# EAGLE design TalkingTom_FINAL9 (EAGLE 7.3.0)
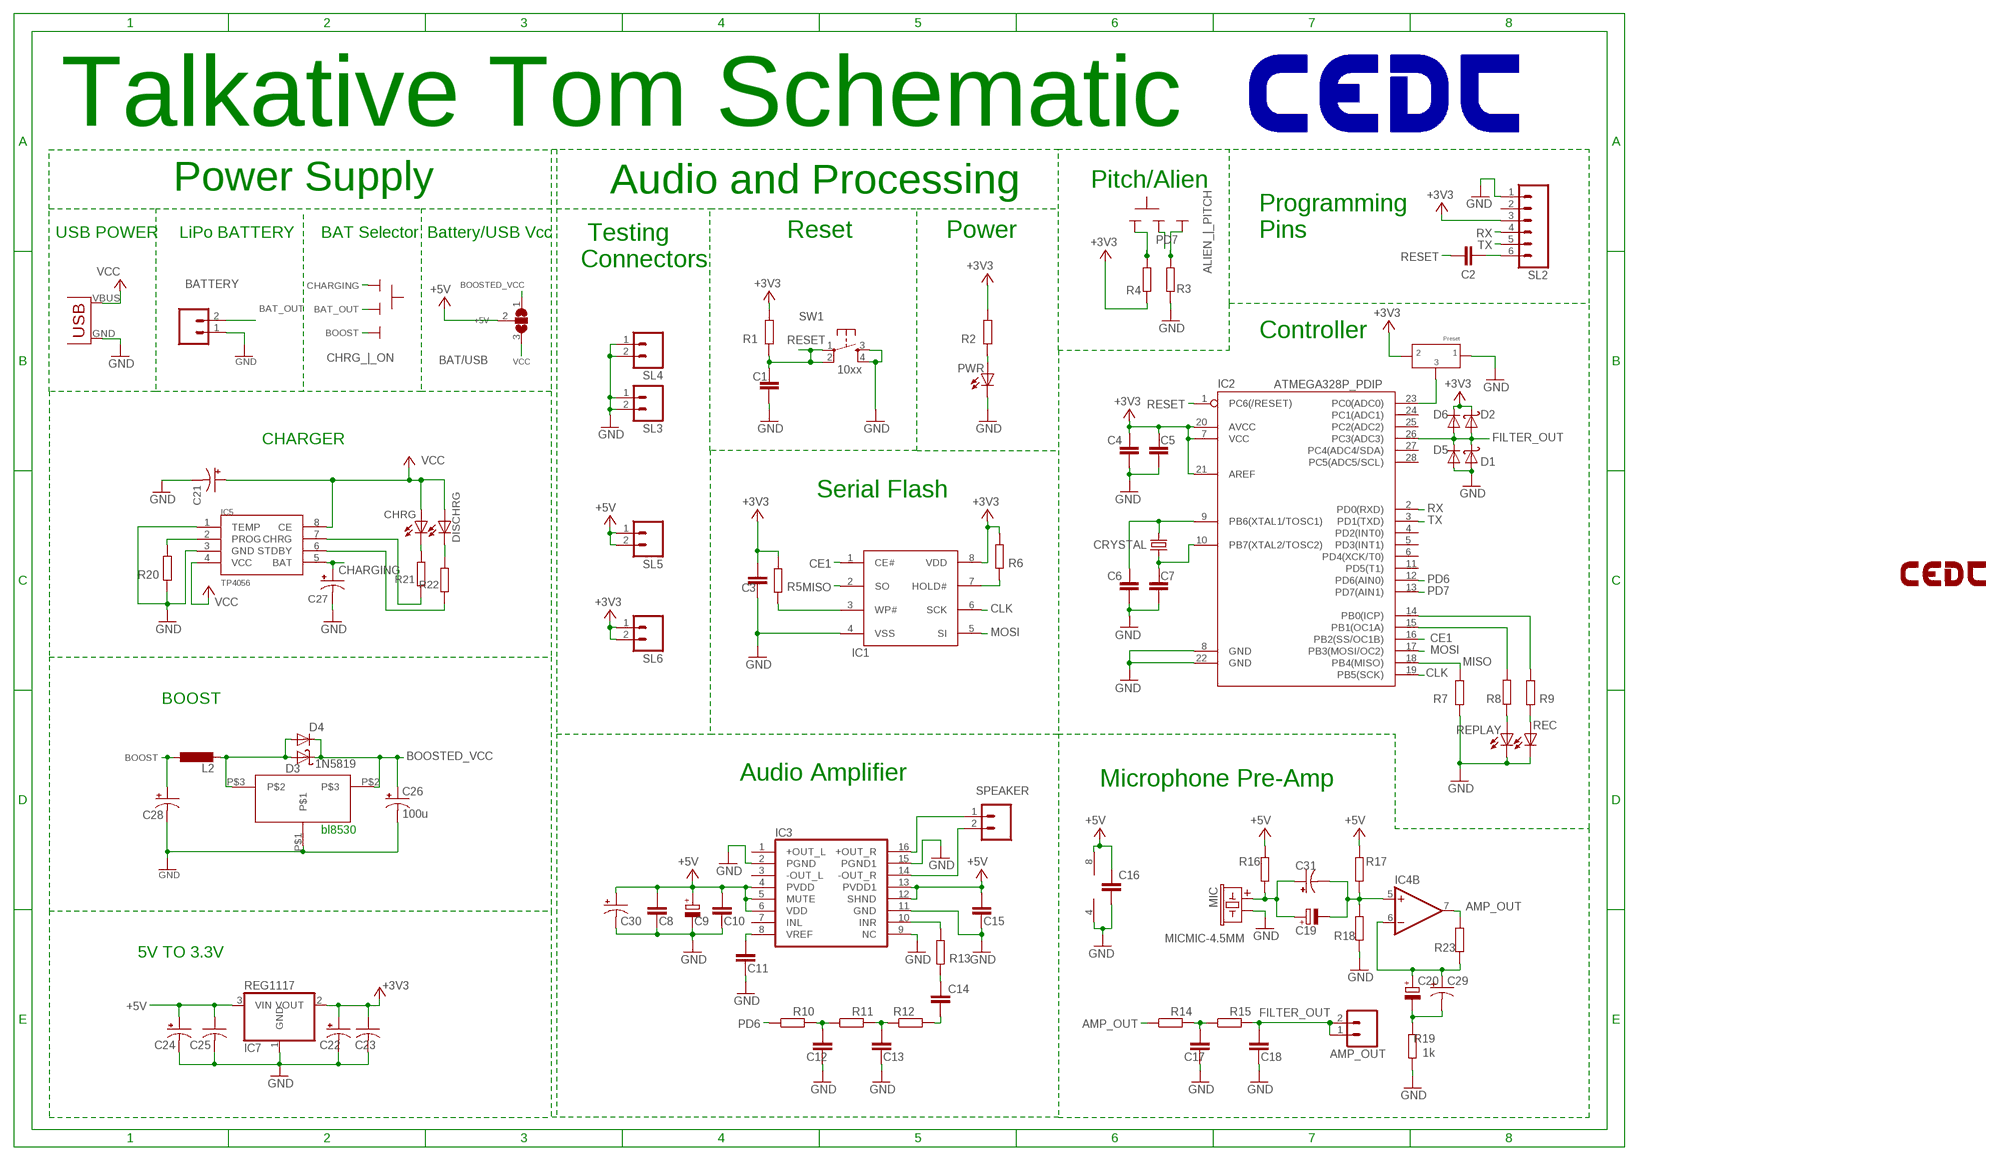
[diagram p0: schematic, sheet 1]

## Parts
ALIEN_|_PITCH  SLIDESWITCH-BIG  [BIGSWITCH]
AMP_OUT  M02  [02P]
BAT/USB  SJ2W  [SJ_2]
BATTERY  M02JST-PTH-2  M02  [02P]
C1  0.1u  C-EUC0805  [C0805]
C2  1uf  C-EUC1206K  [C1206K]
C3  0.1u  C-EUC0805  [C0805]
C4  0.1u  C-EUC0805  [C0805]
C5  0.1u  C-EUC0805  [C0805]
C6  22pf  C-EUC0805  [C0805]
C7  22pf  C-EUC0805  [C0805]
C8  1uf  C-EUC1206  [C1206]
C9  470uF  CPOL-EUE5-10.5  [E5-10,5]
C10  1uf  C-EUC1206  [C1206]
C11  0.1uf  C-EUC1206  [C1206]
C12  0.1u  C-EUC0805  [C0805]
C13  0.1uf  C-EUC0805  [C0805]
C14  0.47uF  C-EUC0603  [C0603]
C15  1uf  C-EUC1206  [C1206]
C16  0.1u  C-EUC0805  [C0805]
C17  0.1u  C-EUC0805  [C0805]
C18  0.1u  C-EUC0805  [C0805]
C19  10u  CPOL-EUE2.5-5  [E2,5-5]
C20  10u  CPOL-EUE2.5-5  [E2,5-5]
C21  10u  CAP_POL_10V  [C/6032-28R]
C22  10u  CAP_POL_10V  [C/6032-28R]
C23  0.1u  CAP0805  [C0805]
C24  10u  CAP_POL_10V  [C/6032-28R]
C25  0.1u  CAP0805  [C0805]
C26  100u  CAP_POL_10V  [C/6032-28R]
C27  10u  CAP_POL_10V  [C/6032-28R]
C28  10u  CAP_POL_10V  [C/6032-28R]
C29  10u  CAP_POL_10V  [C/6032-28R]
C30  CAP_POL_10V  [C/6032-28R]
C31  10u  CAP_POL_10V  [C/6032-28R]
CHRG  LED3MM  [LED3MM]
CHRG_|_ON  SLIDESWITCH-BIG  [BIGSWITCH]
CRYSTAL  16MHz  CRYSTALHC49US  [HC49US]
D1  1N5819  [DO41-10]
D2  1N5819  [DO41-10]
D3  1N5819  [DO41-10]
D4  DIODE_DIODE-DO214AC  [DIODE_DO214AC]
D5  DIODE_DIODE-DO214AC  [DIODE_DO214AC]
D6  DIODE_DIODE-DO214AC  [DIODE_DO214AC]
DISCHRG  LED3MM  [LED3MM]
IC1  SST25VF040B_SPI_FLASH  [SOIC08]
IC2  ATMEGA328P_PDIP  [DIL28-3]
IC3  PAM8403  [SOP-16]
IC4  LM358N  [DIL08]
IC5  TP4056  [SOP-8]
IC6  BL8530_5V  [BL8530_5V]
IC7  REG1117  [SOT223]
L2  47uH  L-EUL5650M  [L5650M]
LOGO2  LOGO-CEDTSILK-18MM  [LOGO-CEDT-SILK-18MM]
MIC  MICMIC-4.5MM  [MIC-4.5MM]
PWR  LED3MM  [LED3MM]
R1  10k  R-EU_0204/7  [0204/7]
R2  1k  R-EU_0204/7  [0204/7]
R3  10k  R-EU_0204/7  [0204/7]
R4  10k  R-EU_0204/7  [0204/7]
R5  10k  R-EU_0204/7  [0204/7]
R6  10k  R-EU_0204/7  [0204/7]
R7  10k  R-EU_0204/7  [0204/7]
R8  1k  R-EU_0204/7  [0204/7]
R9  1k  R-EU_0204/7  [0204/7]
R10  330  R-EU_0204/7  [0204/7]
R11  330  R-EU_0204/7  [0204/7]
R12  R-EU_0204/7  [0204/7]
R13  10k  R-EU_0204/7  [0204/7]
R14  330  R-EU_0204/7  [0204/7]
R15  330  R-EU_0204/7  [0204/7]
R16  4.7k  R-EU_0204/7  [0204/7]
R17  10k  R-EU_0204/7  [0204/7]
R18  20k  R-EU_0204/7  [0204/7]
R19  1k  R-EU_0204/7  [0204/7]
R20  R-EU_0204/7  [0204/7]
R21  470  R-EU_0204/7  [0204/7]
R22  470  R-EU_0204/7  [0204/7]
R23  20k  R-EU_0204/7  [0204/7]
REC  LED3MM  [LED3MM]
REPLAY  LED3MM  [LED3MM]
SL2  M06  [06P]
SL3  M02  [02P]
SL4  M02  [02P]
SL5  M02  [02P]
SL6  M02  [02P]
SPEAKER  M02JST-PTH-VERT  M02  [02P]
SW1  10xx  OMRON_SWITCH_10-XX  [B3F-10XX]
TRIMPOT  Preset  PRESET  [PRESET-LR]
U$1  USB(POWER)  [USB(POWER)]

## Nets
+3V3: C3.1 C4.1 C5.1 C22.+ C23.1 D2.C D6.C IC1.8(VDD) IC2.7(VCC) IC2.20(AVCC) IC2.21(AREF) IC7.2(VOUT) R1.2 R2.2 R4.2 R5.1 R6.2 SL2.3 SL6.1 SL6.2 TRIMPOT.P$2
+5V: BAT/USB.2 C8.1 C9.+ C10.2 C15.2 C16.1 C24.+ C25.1 C30.+ IC3.4(PVDD) IC3.5(MUTE) IC3.6(VDD) IC3.12(SHND) IC3.13(PVDD1) IC4.8(P:V+) IC7.3(VIN) R16.2 R17.2 SL5.1 SL5.2
AMP_OUT: IC4.7(B:OUT) R14.1 R23.2
BAT_OUT: BATTERY.2 CHRG_|_ON.2
BOOST: C28.+ CHRG_|_ON.3 L2.1
BOOSTED_VCC: BAT/USB.1 C26.+ D3.C D4.C IC6.P$2
CE1: IC1.1(CE#) IC2.16(PB2(SS/OC1B))
CHARGING: C27.+ CHRG_|_ON.1 IC5.5(BAT)
CLK: IC1.6(SCK) IC2.19(PB5(SCK))
FILTER_OUT: AMP_OUT.1 AMP_OUT.2 C18.1 D1.C D2.A D5.C D6.A IC2.26(PC3(ADC3)) R15.2
GND: BATTERY.1 C1.2 C3.2 C4.2 C5.2 C6.2 C7.2 C8.2 C9.- C10.1 C11.2 C12.2 C13.2 C15.1 C16.2 C17.2 C18.2 C21.- C22.- C23.2 C24.- C25.2 C26.- C27.- C28.- C30.- D1.A D5.A IC1.4(VSS) IC2.8(GND) IC2.22(GND) IC3.2(PGND) IC3.9(NC) IC3.11(GND) IC3.15(PGND1) IC4.4(P:V-) IC5.1(TEMP) IC5.3(GND) IC6.P$1 IC7.1(GND) MIC.+ PWR.K(C) R3.2 R7.2 R18.1 R19.1 R20.1 REC.K(C) REPLAY.K(C) SL2.1 SL3.1 SL3.2 SL4.1 SL4.2 SW1.3(S) SW1.4(S1) TRIMPOT.P$1 U$1.GND
MICIN1: C13.1 R11.2 R12.1
MISO: IC1.2(SO) IC2.18(PB4(MISO)) R7.1
MOSI: IC1.5(SI) IC2.17(PB3(MOSI/OC2))
N$1: IC2.15(PB1(OC1A)) R8.2
N$2: IC1.7(HOLD#) R6.1
N$3: IC1.3(WP#) R5.2
N$4: IC2.14(PB0(ICP)) R9.1
N$5: R8.1 REPLAY.A
N$6: ALIEN_|_PITCH.3 R3.1
N$7: R9.2 REC.A
N$8: IC3.16(+OUT_R) SPEAKER.1
N$9: IC3.14(-OUT_R) SPEAKER.2
N$10: C14.2 R13.2
N$11: IC3.10(INR) R13.1
N$12: C12.1 R10.2 R11.1
N$13: PWR.A R2.1
N$14: C17.1 R14.2 R15.1
N$18: IC5.2(PROG) R20.2
N$19: IC5.7(CHRG) R21.1
N$20: C14.1 R12.2
N$21: C2.1 SL2.6
N$22: C11.1 IC3.8(VREF)
N$24: ALIEN_|_PITCH.1 R4.1
N$25: IC5.6(STDBY) R22.1
N$27: CHRG.K(C) R21.2
N$28: DISCHRG.K(C) R22.2
N$29: D3.A D4.A IC6.P$3 L2.2
N$30: C19.+ C31.+ MIC.- R16.1
N$32: C19.- C31.- IC4.5(B:+IN) R17.1 R18.2
N$33: C20.+ C29.+ IC4.6(B:-IN) R23.1
N$34: IC2.23(PC0(ADC0)) TRIMPOT.P$3
N$36: C20.- C29.- R19.2
N$53: C6.1 CRYSTAL.2 IC2.9(PB6(XTAL1/TOSC1))
N$54: C7.1 CRYSTAL.1 IC2.10(PB7(XTAL2/TOSC2))
PD6: IC2.12(PD6(AIN0)) R10.1
PD7: ALIEN_|_PITCH.2 IC2.13(PD7(AIN1))
RESET: C1.1 C2.2 IC2.1(PC6(/RESET)) R1.1 SW1.1(P) SW1.2(P1)
RX: IC2.2(PD0(RXD)) SL2.4
TX: IC2.3(PD1(TXD)) SL2.5
VCC: BAT/USB.3 C21.+ CHRG.A DISCHRG.A IC5.4(VCC) IC5.8(CE) U$1.VBUS(VCC)
Unconnected: IC2.4(PD2(INT0)) IC2.5(PD3(INT1)) IC2.6(PD4(XCK/T0)) IC2.11(PD5(T1)) IC2.24(PC1(ADC1)) IC2.25(PC2(ADC2)) IC2.27(PC4(ADC4/SDA)) IC2.28(PC5(ADC5/SCL)) IC3.1(+OUT_L) IC3.3(-OUT_L) IC3.7(INL) IC4.1(A:OUT) IC4.2(A:-IN) IC4.3(A:+IN) SL2.2

## Notes on the sheet
- Talkative Tom Schematic
- Power Supply | Audio and Processing | Pitch/Alien
- USB POWER | LiPo BATTERY | BAT Selector | Battery/USB Vcc | Reset | Power
- Programming
  Pins
- Testing 
  Connectors
- Controller
- CHARGER
- Serial Flash
- BOOST
- Audio Amplifier | Microphone Pre-Amp
- bl8530
- 5V TO 3.3V

## Library data of the parts
ALIEN_|_PITCH CHRG_|_ON = CEDT_JANUARY_2015_v5:SLIDESWITCH
AMP_OUT BATTERY SPEAKER = CEDT_JANUARY_2015_v5:M02: AMP QUICK CONNECTOR
BAT/USB = jumper:SJ2W: SMD solder JUMPER
C1-C8 C10 C11 C14 C15 = rcl:C-EU: CAPACITOR, European symbol
C9 = resistor:CPOL-EU: POLARIZED CAPACITOR, European symbol
C12 C13 C17 C18 = Arduino_Hackathon_v5:C-EU: CAPACITOR, European symbol
C16 = resistor:C-EU: CAPACITOR, European symbol
C19 C20 = rcl:CPOL-EU: POLARIZED CAPACITOR, European symbol
C21 C26 C29 C31 = CEDT_JANUARY_2015_v7:CAP_POL
C22 C24 C27 C28 = CEDT_JANUARY_2015_v5:CAP_POL
C23 C25 = CEDT_JANUARY_2015_v5:CAP
C30 = CEDT_SEPTEMBER_V2:CAP_POL
CHRG DISCHRG = adafruit:LED: LED OSRAM: - CHIPLED LG R971, LG N971, LY N971, LG Q971, LY Q971, LO R971, LY R971 LH N974, LH R974 LS Q976, LO Q976, LY Q976 LO Q996 - Hyper CHIPLED LW Q18S LB Q993, LB Q99A, LB R99A - SideLED LS A670, LO A670, LY A670, LG A670, LP A670 LB A673, LV A673, LT A673, LW A673 LH A674 LY A675 LS A676, LA A676, LO A676, LY A676, LW A676 LS A679, LY A679, LG A679 - Hyper Micro SIDELED® LS Y876, LA Y876, LO Y876, LY Y876 LT Y87S - SmartLED LW L88C, LW L88S LB L89C, LB L89S, LG L890 LS L89K, LO L89K, LY L89K LS L896, LA L896, LO L896, LY L896 - TOPLED LS T670, LO T670, LY T670, LG T670, LP T670 LSG T670, LSP T670, LSY T670, LOP T670, LYG T670 LG T671, LOG T671, LSG T671 LB T673, LV T673, LT T673, LW T673 LH T674 LS T676, LA T676, LO T676, LY T676, LB T676, LH T676, LSB T676, LW T676 LB T67C, LV T67C, LT T67C, LS T67K, LO T67K, LY T67K, LW E67C LS E67B, LA E67B, LO E67B, LY E67B, LB E67C, LV E67C, LT E67C LW T67C LS T679, LY T679, LG T679 LS T770, LO T770, LY T770, LG T770, LP T770 LB T773, LV T773, LT T773, LW T773 LH T774 LS E675, LA E675, LY E675, LS T675 LS T776, LA T776, LO T776, LY T776, LB T776 LHGB T686 LT T68C, LB T68C - Hyper Mini TOPLED® LB M676 - Mini TOPLED Santana® LG M470 LS M47K, LO M47K, LY M47K Source: http://www.osram.convergy.de/
CRYSTAL = CEDT_JANUARY_2015_v5:CRYSTAL: Crystals Various standard crystals. Proven footprints. Spark Fun Electronics SKU : COM-00534
D1 D2 = CEDT_JANUARY_2015_v6 (2):1N5819: DIODE general purpose rectifier, 1 A
D3 = arduinodaya_v9:1N5819: DIODE general purpose rectifier, 1 A
D4-D6 = TalkingTom_FINAL3_print:DIODE_DIODE-: DIODE
IC1 = CEDT_JANUARY_2015_v5:SST25VF040B_SPI_FLASH
IC2 = SparkFun-DigitalIC:ATMEGA328P_PDIP: uC used in the Arduino 32kb flash, 1k EEPROM, 2k SRAM This is the through-hole version of this chip.
IC3 = PAM8403:PAM8403: Dual channel audio amplifier IC - PAM8403
IC4 = CEDT_JANUARY_2015_v6 (2):LM358: OP AMP also LM158; LM258; LM2904 Source: http://cache.national.com/ds/LM/LM158.pdf
IC5 = TP4056:TP4056
IC6 = PSU_TT_SMD:BL8530_5V
IC7 = CEDT_JANUARY_2015_v5:REG1117: 800mA and 1A Low Dropout (LDO) Positive Regulator 1.8V, 2.5V, 2.85V, 3.3V, 5V, and Adj
L2 = rcl:L-EU: INDUCTOR, European symbol
LOGO2 = CEDT_JANUARY_2015_v5:LOGO-CEDT
MIC = arduinodaya_v9:MIC: Microphone Omni-directional electret microphone. 9.7mm standard diameter.
PWR REC REPLAY = 01_adafruit:LED: LED OSRAM: - CHIPLED LG R971, LG N971, LY N971, LG Q971, LY Q971, LO R971, LY R971 LH N974, LH R974 LS Q976, LO Q976, LY Q976 LO Q996 - Hyper CHIPLED LW Q18S LB Q993, LB Q99A, LB R99A - SideLED LS A670, LO A670, LY A670, LG A670, LP A670 LB A673, LV A673, LT A673, LW A673 LH A674 LY A675 LS A676, LA A676, LO A676, LY A676, LW A676 LS A679, LY A679, LG A679 - Hyper Micro SIDELED® LS Y876, LA Y876, LO Y876, LY Y876 LT Y87S - SmartLED LW L88C, LW L88S LB L89C, LB L89S, LG L890 LS L89K, LO L89K, LY L89K LS L896, LA L896, LO L896, LY L896 - TOPLED LS T670, LO T670, LY T670, LG T670, LP T670 LSG T670, LSP T670, LSY T670, LOP T670, LYG T670 LG T671, LOG T671, LSG T671 LB T673, LV T673, LT T673, LW T673 LH T674 LS T676, LA T676, LO T676, LY T676, LB T676, LH T676, LSB T676, LW T676 LB T67C, LV T67C, LT T67C, LS T67K, LO T67K, LY T67K, LW E67C LS E67B, LA E67B, LO E67B, LY E67B, LB E67C, LV E67C, LT E67C LW T67C LS T679, LY T679, LG T679 LS T770, LO T770, LY T770, LG T770, LP T770 LB T773, LV T773, LT T773, LW T773 LH T774 LS E675, LA E675, LY E675, LS T675 LS T776, LA T776, LO T776, LY T776, LB T776 LHGB T686 LT T68C, LB T68C - Hyper Mini TOPLED® LB M676 - Mini TOPLED Santana® LG M470 LS M47K, LO M47K, LY M47K Source: http://www.osram.convergy.de/
R1-R11 R14 R15 R18 R20-R23 = rcl:R-EU_: RESISTOR, European symbol
R12 R13 R16 R17 R19 = resistor:R-EU_: RESISTOR, European symbol
SL2 = con-amp-quick:M06: AMP QUICK CONNECTOR; OC_FARNELL: unknown; OC_NEWARK: unknown
SL3-SL6 = CEDT_JANUARY_2015_v7:M02: AMP QUICK CONNECTOR
SW1 = CEDT_JANUARY_2015_v5:OMRON_SWITCH
TRIMPOT = MSP PROJECT LIBRARY:PRESET: Preset (Variable Resistor) Cermet rotary variable resistor Sunrom Product Page <http://www.sunrom.com/p/100k-cermet-preset>; SUNROM: 4553
U$1 = CEDT_JANUARY_2015_v7:USB(POWER)

## Net classes
0 default: width 0.508 mm

## Board
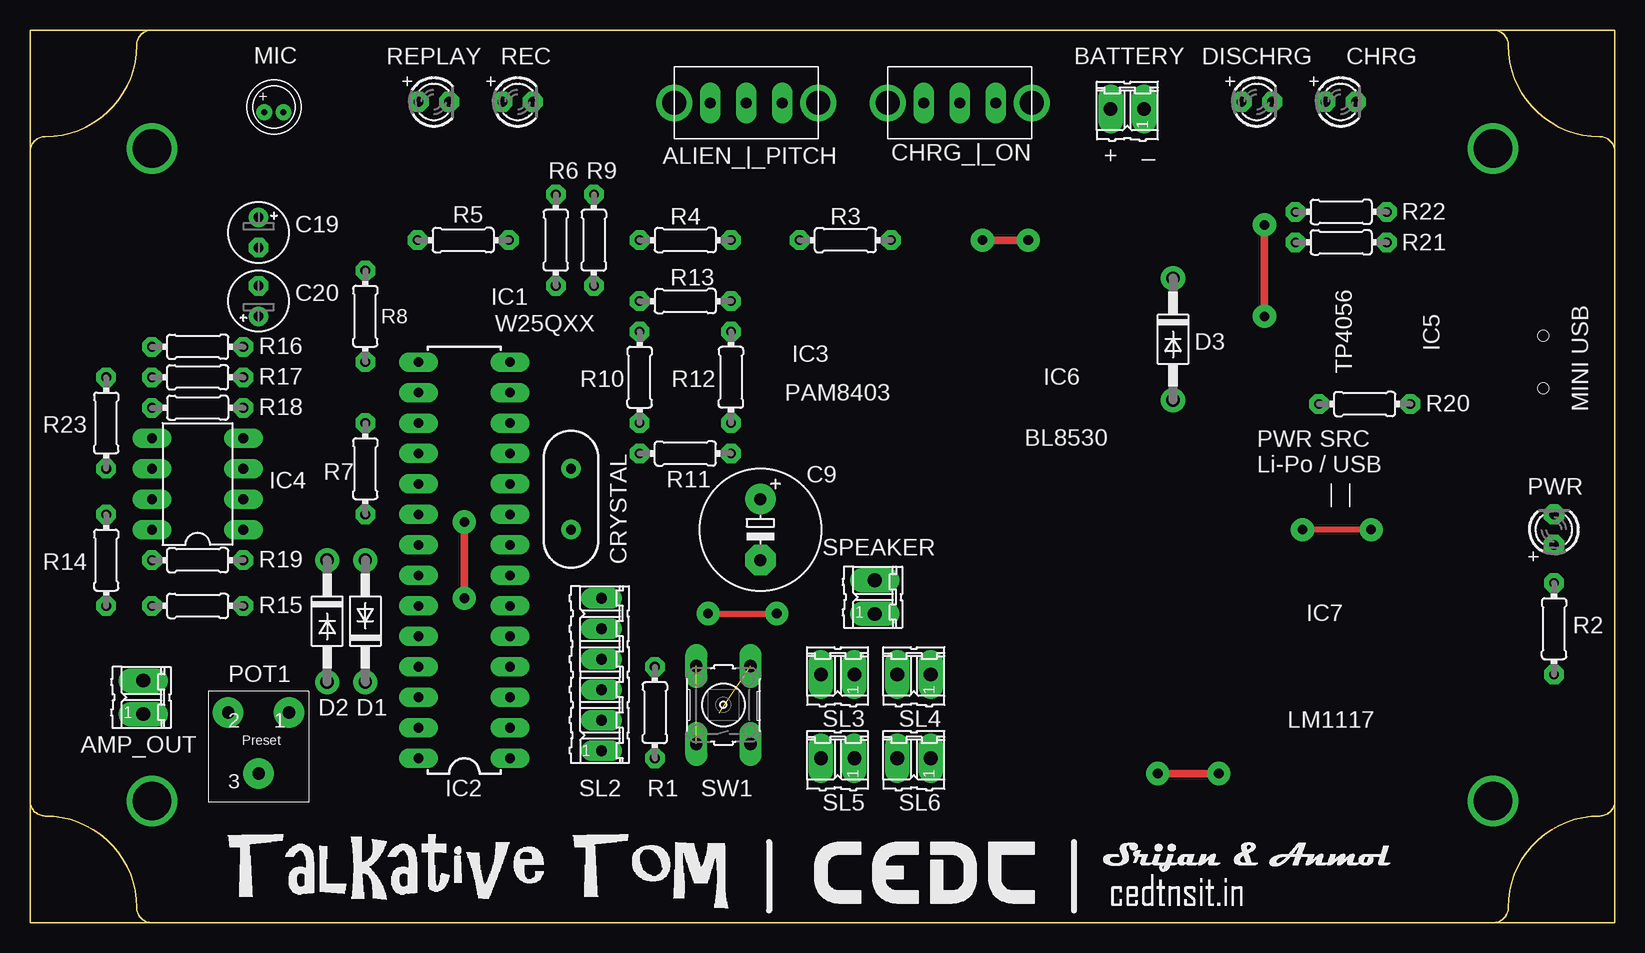
[diagram p1: board, top side]
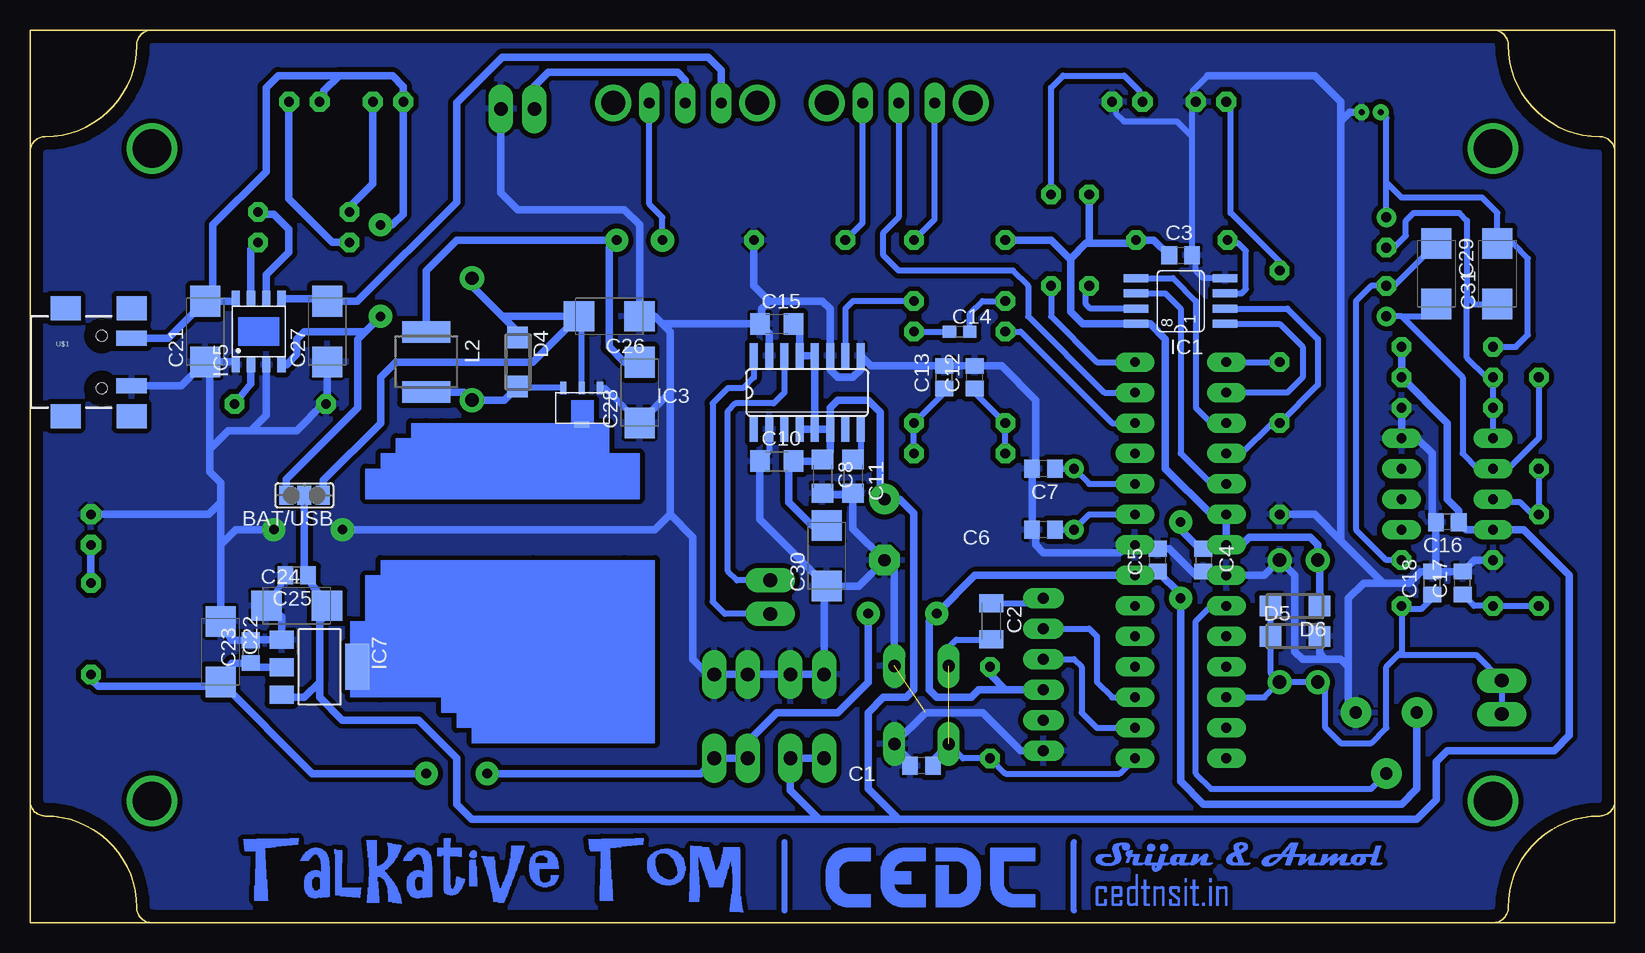
[diagram p2: board, bottom side, seen from below]

Size 132.08 x 74.39 mm. Coordinates in mm from the lower left corner, seen from the top.
Outline: 10.16,0 121.92,0 arc90 123.19,1.27
Outline: 123.19,1.27 arc-90 130.81,8.89 arc90 132.08,10.16 132.08,64.23 arc90 130.81,65.5 arc-90 123.19,73.12 arc90 121.92,74.39 10.16,74.39 arc90 8.89,73.12 arc-90 1.27,65.5 arc90 0,64.23 0,10.16 arc90 1.27,8.89 arc-90 8.89,1.27
Outline: 10.16,0 arc-90 8.89,1.27
Outline: 10.16,0 arc-90 8.89,1.27
Copper layers (1*16): Top 0.035mm / dielectric 1.5mm / Bottom 0.035mm
Design rules "default *": minimum track width 20mil, minimum drill 24mil, track to track 16mil, track to pad 16mil, pad to pad 16mil, via to via 16mil, smd to smd 8mil, copper to edge 40mil, drill to drill 8mil, minimum pad ring 16mil, minimum via ring 16mil, stop-mask expansion 4mil, vias tented up to drill 0mil, thermal gap 10mil
Milling: area 0,64.2 to 10.2,74.4; area 121.9,64.2 to 132.1,74.4; area 121.9,0 to 132.1,10.2; area 0,0 to 10.2,10.2

### Footprints (pad centres in the part's own frame; a part is rotated, then mirrored left to right if it is on the bottom)
BIGSWITCH = drill 0.9 long: 1 -3,0; 2 0,0; 3 3,0 | drill 2 pad 2.184: TAB1 -6,0; TAB2 6,0
02P = drill 1.143 long: 1 -1.397,0; 2 1.397,0
SJ_2 = smd 1.168 x 1.6: 1 -1.524,0; 2 0,0; 3 1.524,0
C0805 = smd 1.3 x 1.5: 1 -0.95,0; 2 0.95,0
C1206K = smd 1.5 x 2: 1 -1.5,0; 2 1.5,0
C1206 = smd 1.6 x 1.8: 1 -1.4,0; 2 1.4,0
E5-10,5 = drill 1.016 pad 2.54: + -2.54,0 | drill 1.016 pad 2.54 octagon: - 2.54,0
C0603 = smd 1.1 x 1: 1 -0.85,0; 2 0.85,0
E2,5-5 = drill 0.813 pad 1.6: + -1.27,0 | drill 0.813 pad 1.6 octagon: - 1.27,0
C/6032-28R = smd 2.55 x 2.5: + 2.525,0; - -2.525,0
LED3MM = drill 0.813 pad 1.676 octagon: A -1.27,0; K 1.27,0
HC49US = drill 0.813: 1 -2.54,0; 2 2.54,0
DO41-10 = drill 1.118: A 5.08,0; C -5.08,0
DIODE_DO214AC = smd 1.8 x 1.7: A 2.05,0; C -2.05,0
SOIC08 = smd 0.66 x 2.032: 1 -1.905,-3.708; 2 -0.635,-3.708; 3 0.635,-3.708; 4 1.905,-3.708; 5 1.905,3.708; 6 0.635,3.708; 7 -0.635,3.708; 8 -1.905,3.708
DIL28-3 = drill 0.813 long: 1 -16.51,-3.81; 2 -13.97,-3.81; 3 -11.43,-3.81; 4 -8.89,-3.81; 5 -6.35,-3.81; 6 -3.81,-3.81; 7 -1.27,-3.81; 8 1.27,-3.81; 9 3.81,-3.81; 10 6.35,-3.81; 11 8.89,-3.81; 12 11.43,-3.81; 13 13.97,-3.81; 14 16.51,-3.81; 15 16.51,3.81; 16 13.97,3.81; 17 11.43,3.81; 18 8.89,3.81; 19 6.35,3.81; 20 3.81,3.81; 21 1.27,3.81; 22 -1.27,3.81; 23 -3.81,3.81; 24 -6.35,3.81; 25 -8.89,3.81; 26 -11.43,3.81; 27 -13.97,3.81; 28 -16.51,3.81
SOP-16 = smd 0.66 x 2.032: 1 -4.445,-3.073; 2 -3.175,-3.073; 3 -1.905,-3.073; 4 -0.635,-3.073; 5 0.635,-3.073; 6 1.905,-3.073; 7 3.175,-3.073; 8 4.445,-3.073; 9 4.445,3.073; 10 3.175,3.073; 11 1.905,3.073; 12 0.635,3.073; 13 -0.635,3.073; 14 -1.905,3.073; 15 -3.175,3.073; 16 -4.445,3.073
DIL08 = drill 0.813 long: 1 -3.81,-3.81; 2 -1.27,-3.81; 3 1.27,-3.81; 4 3.81,-3.81; 5 3.81,3.81; 6 1.27,3.81; 7 -1.27,3.81; 8 -3.81,3.81
SOP-8 = smd 1.3 x 0.7: 1 -2.75,1.905; 2 -2.75,0.635; 3 -2.75,-0.635; 4 -2.75,-1.905; 5 2.75,-1.905; 6 2.75,-0.635; 7 2.75,0.635; 8 2.75,1.905
BL8530_5V = smd 0.508 x 1.016: P$1 0.762,-0.381; P$2 2.286,-0.381; P$3 3.81,-0.381 | smd 1.27 x 0.508: P$4 2.286,2.667
SOT223 = smd 1.499 x 2.007: 1 -2.261,-3.15; 2 0.025,-3.15; 3 2.311,-3.15 | smd 3.81 x 2.007: 4 0,3.15
L5650M = smd 1.8 x 4: 1 -2.5,0; 2 2.5,0
MIC-4.5MM = drill 0.5: + 0.8,0.5; - -0.8,0.5
0204/7 = drill 0.813 octagon: 1 -3.81,0; 2 3.81,0
06P = drill 0.914 long: 1 -6.35,0; 2 -3.81,0; 3 -1.27,0; 4 1.27,0; 5 3.81,0; 6 6.35,0
B3F-10XX = drill 1.016 long: 1 -3.251,2.261; 2 3.251,2.261; 3 -3.251,-2.261; 4 3.251,-2.261
PRESET-LR = drill 1.016 pad 2.54: P$1 -2.54,-2.54; P$2 2.54,-2.54; P$3 0,2.54
USB(POWER) = smd 2.54 x 1.27: GND 2.5,-1.981; VBUS 2.5,1.981 | smd 2.5 x 2: GND@1 -3,-4.5; GND@2 -3,4.5; GND@3 2.5,4.5; GND@4 2.5,-4.5 | hole 0.9: 0,2.2; 0,-2.2

### Placement (x,y rotation side)
ALIEN_|_PITCH  59.69,68.31 0 top
AMP_OUT  9.43,18.78 90 top
BAT/USB  109.22,35.61 180 bottom
BATTERY  91.44,67.81 180 top
C1  57.79,13.07 180 bottom
C2  51.98,25.13 270 bottom
C3  36.2,55.61 0 bottom
C4  34.29,30.21 270 bottom
C5  38.1,30.21 90 bottom
C6  47.62,32.75 180 bottom
C7  47.62,37.83 180 bottom
C8  66.04,37.2 270 bottom
C9  60.87,32.75 270 top
C10  69.85,38.46 0 bottom
C11  63.5,37.2 270 bottom
C12  53.34,45.45 90 bottom
C13  55.88,45.45 90 bottom
C14  54.61,49.26 0 bottom
C15  69.85,49.89 0 bottom
C16  13.97,33.38 180 bottom
C17  12.7,28.3 90 bottom
C18  15.24,28.3 90 bottom
C19  19.05,57.51 270 top
C20  19.05,51.8 90 top
C21  117.48,49.26 90 bottom
C22  116.2,22.59 270 bottom
C23  113.67,22.59 90 bottom
C24  109.86,26.4 0 bottom
C25  109.86,28.94 180 bottom
C26  83.82,50.53 180 bottom
C27  107.31,49.26 90 bottom
C28  81.28,44.18 90 bottom
C29  14.88,54.07 270 bottom
C30  65.67,30.57 90 bottom
C31  9.8,54.07 90 bottom
CHRG  109.22,68.41 0 top
CHRG_|_ON  77.47,68.31 0 top
CRYSTAL  45.09,35.29 270 top
D1  27.94,25.13 90 top
D2  24.77,25.13 270 top
D3  95.25,48.62 270 top
D4  91.44,46.72 270 bottom
D5  26.67,23.86 0 bottom
D6  26.67,26.4 180 bottom
DISCHRG  102.23,68.41 0 top
IC1  36.2,51.8 90 bottom
IC2  36.2,30.21 90 top
IC3  67.31,44.18 0 bottom
IC4  13.97,36.56 90 top
IC5  113.03,49.26 90 bottom
IC6  83.82,44.18 180 bottom
IC7  107.95,21.32 270 bottom
L2  99.06,46.72 270 bottom
LOGO2  65.4,1.63 0 top
MIC  20.32,67.04 0 top
PWR  127,32.75 90 top
R1  52.07,17.51 90 top
R2  127,24.5 270 top
R3  67.95,56.88 0 top
R4  54.61,56.88 180 top
R5  36.1,56.88 180 top
R6  43.82,56.88 90 top
R7  27.94,37.83 270 top
R8  27.94,50.53 270 top
R9  46.99,56.88 90 top
R10  50.8,45.45 270 top
R11  54.61,39.1 0 top
R12  58.42,45.45 90 top
R13  54.61,51.8 180 top
R14  6.35,30.21 270 top
R15  13.97,26.4 0 top
R16  13.97,47.99 0 top
R17  13.97,45.45 0 top
R18  13.97,42.91 180 top
R19  13.97,30.21 0 top
R20  111.22,43.23 0 top
R21  109.26,56.69 180 top
R22  109.26,59.23 180 top
R23  6.35,41.64 270 top
REC  40.64,68.41 0 top
REPLAY  33.66,68.41 0 top
SL2  47.62,20.68 90 top
SL3  67.31,20.68 180 top
SL4  73.66,20.68 180 top
SL5  67.31,13.7 180 top
SL6  73.66,13.7 180 top
SPEAKER  70.39,27.13 90 top
SW1  57.79,18.14 90 top
TRIMPOT  19.05,14.97 180 top
U$1  126.11,46.72 0 bottom

### Tracks (layer width: path | path; a pad name or v marks a point on that pad's centre or on a via)
+3V3  (via drill 0.8 pad 1.93)
  Top 0.508: v56.51,25.77 v62.23,25.77
  Top 0.61: v36.19,33.39 v36.19,27.04 | v93.98,12.43 v99.06,12.43
  Bottom 0.508: 38.42,28.94 C5.1 | C4.1 34.6,31.16 | v36.19,27.04 36.19,27.36 | 33.65,34.02 IC2.20 | 57.15,25.13 v56.51,25.77 | 45.35,55.25 45.35,55.34 | 43.81,56.88 44.08,56.61
  Bottom 0.61: 38.42,28.94 IC2.7 53.34,28.94 v56.51,25.77 | IC2.21 33.97,31.48 C4.1 | 34.6,31.16 36.19,32.75 v36.19,33.39 | 36.19,27.36 C5.1 | R1.2 52.07,20.69 50.8,19.42 | 50.8,19.42 SL2.3 | 57.15,25.13 57.15,19.42 56.51,18.78 53.66,18.78 53.02,19.42 50.8,19.42 | IC2.21 IC2.20 | 33.65,34.02 37.46,37.83 37.46,48.63 38.73,49.9 IC1.8 44.35,49.9 45.35,50.9 45.35,55.25 46.99,56.88 R4.2 | v62.23,25.77 62.23,20.05 64.77,17.51 69.85,17.51 72.39,14.97 72.39,13.83 SL6.2 SL6.1 75.06,13.57 76.2,12.43 v93.98,12.43 | IC7.2 113.95,21.29 C23.1 115.26,21.64 C22.+ | v36.19,27.04 36.19,11.8 34.29,9.89 17.78,9.89 16.51,11.16 TRIMPOT.P$2 | IC2.21 31.11,31.48 30.48,32.12 25.4,32.12 24.76,31.48 D2.C 24.62,30.06 D6.C | C3.1 38.41,56.88 R5.1 40.18,56.61 44.08,56.61 45.35,55.34 | R6.2 43.81,56.88 | R2.2 127,20.3 126.38,19.69 116.58,19.69 C22.+ | v99.06,12.43 108.57,12.43 C22.+
+5V
  Bottom 0.508: 66.17,38.47 C8.1 | 108.9,28.61 C25.1 | 68.21,38.23 C10.2 68.85,38.07 | C30.+ 66.93,33.1
  Bottom 0.61: IC3.5 IC3.12 IC3.13 67.94,49.39 C15.2 68.58,50.03 | IC3.6 65.4,42.91 64.77,43.55 62.23,43.55 61.23,42.55 61.23,35.66 C9.+ 59.59,35.29 58.42,34.12 58.42,19.42 59.05,18.78 60.96,18.78 62.23,17.51 62.23,11.16 59.69,8.62 | C10.2 66.17,38.47 | IC3.4 IC3.5 | IC3.5 IC3.6 | C8.1 65.4,39.23 IC3.6 | R16.2 R17.2 13.97,41.64 13.97,35.29 13.02,34.34 C16.1 12.38,32.75 IC4.8 7.62,32.75 3.81,28.94 3.81,15.61 5.08,14.34 13.97,14.34 14.87,13.43 14.87,10.26 16.51,8.62 59.69,8.62 | 66.31,8.62 95.25,8.62 96.52,9.89 96.52,13.7 99.69,16.88 106.04,16.88 107.95,18.78 107.95,20.05 | 66.31,8.62 59.69,8.62 | 110.68,18.59 IC7.3 110.87,18.78 109.22,18.78 107.95,20.05 | 107.95,20.05 107.95,25.13 107.31,25.77 C24.+ 108.9,28.61 | SL5.2 SL5.1 68.71,11.02 66.31,8.62 | 66.93,33.1 68.85,35.02 68.85,38.07 | BAT/USB.2 109.22,29.26 C25.1
AMP_OUT
  Bottom 0.508: R23.2 R14.1 6.89,34.02 7.89,35.02 9.89,35.02 IC4.7
BAT_OUT
  Bottom 0.61: CHRG_|_ON.2 77.47,70.22 78.1,70.85 88.9,70.85 90.04,69.71 BATTERY.2
BOOST  (via drill 0.8 pad 1.93)
  Top 0.61: v79.37,56.88 v83.18,56.88
  Bottom 0.508: 81.29,46.72 C28.+ | 79.2,57.06 79.37,57.23 79.37,58.78 80.47,59.88 CHRG_|_ON.3
  Bottom 0.61: 81.29,46.72 82.55,46.72 83.82,47.99 83.82,56.25 v83.18,56.88 96.52,56.88 99.06,54.34 L2.1 | v79.37,56.88 79.2,57.06
BOOSTED_VCC
  Bottom 0.508: IC6.P$2 86.11,50.29 | C26.+ | D4.C 91.44,49.26
  Bottom 0.61: 86.11,50.29 C26.+ | BAT/USB.1 107.63,36.88 102.87,41.64 102.87,45.45 101.6,46.72 90.17,46.72 C26.+ 92.71,50.53 | 92.71,50.53 95.25,53.07 D3.C | 91.44,49.26 92.71,50.53
CE1
  Bottom 0.508: IC2.16 27.3,44.18 26.03,45.45 26.03,47.99 27.94,49.9 IC1.1
CHARGING
  Bottom 0.61: IC5.5 106.9,52.01 C27.+ 104.79,51.79 96.52,60.06 96.52,68.31 92.71,72.12 75.56,72.12 74.47,71.03 CHRG_|_ON.1
CLK
  Bottom 0.508: IC1.6 37.46,52.44 36.19,51.17 36.19,39.1 33.65,36.56 IC2.19
FILTER_OUT
  Bottom 0.508: D1.C D2.A 24.13,19.42 24.13,16.24 22.86,14.97 20.32,14.97 19.05,16.24 19.05,21.32 18.05,22.32 | IC2.26 29.21,18.78 D1.C | AMP_OUT.1 AMP_OUT.2 11.57,22.32 18.05,22.32 | 18.05,22.32 17.78,22.59 R15.2 17.51,26.13 16.14,26.13 15.24,27.04 C18.1 | D1.C 28.72,20.83 D5.C D6.A
GND  (via drill 0.8 pad 1.93)  (1 unrouted)
  Top 0.508: v111.76,32.75 v106.04,32.75
  Bottom 0.508: IC3.2 70.48,39.23 C10.1 71.75,38.47 71.63,38.34 | 34.61,28.94 C4.2 | 71.12,49.9 C15.1 71.12,50.03 | IC1.4 34.29,53.71 34.92,54.34 34.92,55.29 C3.2 35.24,65.5 | C1.2 58.73,13.58 SW1.3 | IC6.P$1 84.19,44.56 C28.- 81.26,41.66 | C24.- 110.8,28.61 C25.2 | IC5.1 115.16,46.74 | 63.64,35.66 C11.2 | 35.24,65.5 35.24,68.09 REPLAY.K 35.19,68.68 35.19,69.31 33.92,70.58 | REC.K 41.54,68.04 41.54,67.41 40.91,66.77 36.51,66.77 35.24,65.5 | SL4.1 75.06,20.91 75.2,21.05 | 78.74,34.02 | 74.29,49.9 74.3,49.89 | 22.22,21.32 | 26.67,28.94
  Bottom 0.61: C4.2 33.97,28.94 IC2.22 29.21,28.94 D1.A 26.67,28.94 26.67,22.59 26.03,21.95 24.13,21.95 | 34.61,28.94 34.92,28.94 37.14,31.16 C5.2 38.42,31.48 IC2.8 40.64,31.48 41.27,30.85 47.62,30.85 48.26,31.48 48.26,32.44 C6.2 C7.2 48.26,38.15 48.26,43.55 51.11,46.4 C12.2 C13.2 62.01,46.4 IC3.9 62.86,46.09 63.5,45.45 64.77,45.45 65.4,46.09 IC3.11 65.4,51.17 66.04,51.8 70.48,51.8 | IC3.15 70.48,49.13 C15.1 74.29,49.9 | SL2.1 49.53,14.34 52.7,17.51 57.43,17.51 SW1.3 | R18.1 IC4.4 16.51,40.37 15.24,39.1 15.24,33.71 C16.2 14.92,29.58 C18.2 | SL4.1 SL4.2 SL3.1 | 116.19,25.13 C22.- | C24.- 111.11,25.5 IC7.1 114.26,23.58 C23.2 115.26,23.54 C22.- | 81.28,50.55 C26.- | 81.28,50.55 80.02,50.55 79.37,49.89 | 79.37,49.89 78.74,49.26 78.74,44.2 | 78.74,44.2 C28.- | 116.2,35.02 116.2,31.48 | 116.2,31.48 C22.- | v106.04,32.75 80.01,32.75 78.74,34.02 78.74,44.2 | 22.86,66.77 22.86,68.41 25.03,70.58 33.92,70.58 | 22.86,66.77 22.86,31.85 | 115.16,46.74 C21.- | R7.2 25.03,34.02 22.86,31.85 | v111.76,32.75 114.93,32.75 116.2,31.48 | U$1.GND 119.47,44.74 C21.- | 70.48,51.8 71.12,51.17 71.12,50.03 | PWR.K 117.2,34.02 116.2,35.02 | SL3.1 SL3.2 65.91,27.81 C30.- | 68.58,20.81 SL3.1 | TRIMPOT.P$1 22.22,18.15 22.22,21.32 22.86,21.95 24.13,21.95 | C18.2 16.19,29.26 17.14,28.31 19.32,28.31 | 81.28,50.55 81.28,58.15 82.55,59.42 91.44,59.42 92.84,60.82 BATTERY.1 | R19.1 11.74,30.21 C17.2 C18.2 | 22.86,31.85 19.32,28.31 | 63.64,35.66 65.9,35.66 C8.2 | 116.2,35.02 116.2,36.66 117.11,37.56 117.11,39.46 | 117.11,39.46 117.11,46.37 C21.- | MIC.+ 22.09,67.54 22.86,66.77 | R3.2 71.75,53.07 70.48,51.8 | 75.2,21.05 75.93,21.05 76.83,21.95 76.83,32.11 78.74,34.02
  Bottom 0.61: 74.3,49.89 79.37,49.89 | SW1.4 60.05,29.39 C9.- | C30.- 63.02,28.05 C9.- | C9.- 63.5,32.85 C11.2 | C10.1 71.25,33.63 C30.- | 19.32,28.31 20.95,28.31 22.22,27.03 22.22,21.32 | D5.A 24.62,22.44 24.13,21.95 | C27.- 107.31,43.32 R20.1 107.63,43.23 109.85,41 113.66,41 | 113.66,41 115.57,41 117.11,39.46 | IC5.3 112.39,42.27 113.66,41
  pour Bottom: 0.36,64.3 arc-90 1.18,65.12 1.23,65.12 1.26,65.12 arc90 9.21,73.07 arc-90 10.16,74.02 121.92,74.02 arc-90 122.87,73.07 122.87,72.75 arc90 130.49,65.13 130.81,65.13 arc-90 131.76,64.18 131.76,10.52 arc-90 130.49,9.25 arc90 122.87,1.63 122.87,1.32 arc-90 121.92,0.36 10.16,0.36 arc-90 9.21,1.32 arc90 1.27,9.25 arc-90 0.32,10.21 0.32,64.18
MICIN1
  Bottom 0.508: R11.2 R12.1 55.88,44.18 C13.1
MISO
  Bottom 0.508: IC2.18 31.11,39.1 28.57,41.64 R7.1 24.76,44.82 24.76,48.63 27.3,51.17 IC1.2
MOSI
  Bottom 0.508: IC1.5 36.83,53.71 34.92,51.8 34.92,42.91 33.65,41.64 IC2.17
N$1
  Bottom 0.508: IC2.15 R8.2
N$2
  Bottom 0.508: IC1.7 43.72,51.17 44.08,51.53 44.08,52.8 R6.1
N$3
  Bottom 0.508: IC1.3 31.11,52.44 30.75,52.8 30.75,55.98 31.38,56.61 32.02,56.61 R5.2
N$4
  Bottom 0.508: R9.1 46.99,50.53 43.18,46.72 IC2.14
N$5
  Bottom 0.508: R8.1 27.94,55.07 32.02,59.15 32.02,68.04 REPLAY.A
N$6
  Bottom 0.508: R3.1 62.69,58.33 ALIEN_|_PITCH.3
N$7
  Bottom 0.508: R9.2 46.99,69.58 45.99,70.58 40.91,70.58 39.64,69.31 39.64,68.68 REC.A
N$8
  Bottom 0.508: IC3.16 71.75,45.45 72.66,44.55 73.93,44.55 75.2,43.28 75.2,26.77 74.17,25.73 SPEAKER.1
N$9
  Bottom 0.508: IC3.14 69.21,44.18 70.12,43.28 73.29,43.28 73.93,42.64 73.93,29.31 73.15,28.53 SPEAKER.2
N$10
  Bottom 0.508: C14.2 53.76,50.75 52.7,51.8 R13.2
N$11
  Bottom 0.508: IC3.10 64.13,51.17 63.5,51.8 R13.1
N$12
  Bottom 0.508: R11.1 R10.2 53.34,44.18 C12.1
N$13
  Bottom 0.61: R2.1 PWR.A
N$14
  Bottom 0.508: C17.1 11.74,26.4 R15.1 R14.2
N$15  (via drill 3.2 pad 3.81)
  other vias: 10.16,10.14
N$16  (via drill 3.2 pad 3.81)
  other vias: 121.92,64.5
N$17  (via drill 3.2 pad 3.81)
  other vias: 121.92,10.14
N$18
  Bottom 0.61: IC5.2 113.66,44.91 R20.2
N$19
  Bottom 0.61: IC5.7 113.66,56.1 R21.1
N$20
  Bottom 0.508: R12.2 C14.1
N$21
  Bottom 0.508: C2.1 48.03,26.63 SL2.6
N$22
  Bottom 0.508: IC3.8 62.86,39.23 C11.1
N$23  (via drill 3.2 pad 3.81)
  other vias: 10.16,64.5
N$24
  Bottom 0.508: R4.1 56.69,58.61 ALIEN_|_PITCH.1
N$25
  Bottom 0.61: IC5.6 112.39,54 110.51,55.88 110.51,57.79 111.78,59.06 112.89,59.06 R22.1
N$26
  Bottom 0.508: 45.08,1 45.08,6.71
N$27
  Bottom 0.61: R21.2 106.87,56.69 110.51,60.33 110.51,68.39 CHRG.K
N$28
  Bottom 0.61: R22.2 105.45,59.67 103.52,61.6 103.52,68.39 DISCHRG.K
N$29
  Bottom 0.508: IC6.P$3 91.01,44.56 D4.A
  Bottom 0.61: D4.A 92.56,43.55 D3.A 95.92,44.22 L2.2
N$30
  Bottom 0.508: C19.+ 19.05,61.69 | 19.05,61.69 19.05,67.07 MIC.- | R16.1 8.25,47.99 7.25,48.99 7.25,55.34 8.52,56.61 9.14,56.61 C31.+ 9.79,59.15 11.06,60.42 17.78,60.42 19.05,61.69
N$31
  Bottom 0.508: 69.21,6.71 69.21,1
N$32
  Bottom 0.508: R18.2 IC4.5 R17.1 10.7,45.45 12.33,47.09 12.33,52.17 | C19.- 18.41,56.25 17.41,57.25 17.41,58.52 16.78,59.15 12.97,59.15 12.33,58.52 12.33,52.17 | 12.33,52.17 11.7,51.53 10.44,51.53 C31.-
N$33
  Bottom 0.508: R23.1 6.35,40.37 8.89,37.83 IC4.6 11.43,37.83 12.7,39.1 12.7,45.45 17.78,50.53 | 17.78,50.53 C20.+ | 17.78,50.53 15.89,50.53 C29.+
N$34
  Bottom 0.508: IC2.23 33.65,26.4 34.92,25.13 34.92,12.43 33.65,11.16 20.32,11.16 TRIMPOT.P$3
N$36
  Bottom 0.508: R19.2 19.05,30.21 21.59,32.75 21.59,51.8 20.32,53.07 C20.- 18.4,53.07 C29.-
N$53
  Bottom 0.508: C6.1 CRYSTAL.2 43.81,34.02 IC2.9
N$54
  Bottom 0.508: C7.1 CRYSTAL.1 43.81,36.56 IC2.10
PD6
  Bottom 0.508: R10.1 49.53,49.26 41.91,41.64 IC2.12
PD7
  Bottom 0.508: IC2.13 42.54,44.18 48.89,50.53 48.89,53.07 50.16,54.34 59.69,54.34 60.96,55.61 60.96,57.52 59.69,58.79 ALIEN_|_PITCH.2
RESET  (1 unrouted)
  Bottom 0.508: IC2.1 41.27,12.43 50.8,12.43 R1.1 54.33,13.7 SW1.1 56.83,13.58 C1.1 | SW1.2 55.52,22.95 54.88,23.59 52.01,23.59 C2.2
RX
  Bottom 0.508: 40.96,16.24 IC2.2 43.18,16.24 44.45,17.51 44.45,21.32 45.08,21.96 SL2.4
TX
  Bottom 0.508: 40.96,18.78 IC2.3 41.91,18.78 43.18,20.05 43.18,23.86 43.81,24.5 SL2.5
VCC  (via drill 0.8 pad 1.93)
  Top 0.61: v102.87,50.53 v102.87,58.15
  Bottom 0.508: IC5.8 115.16,51.79 | 104.14,49.26
  Bottom 0.61: BAT/USB.3 110.74,36.94 104.77,42.91 104.77,48.63 104.14,49.26 v102.87,50.53 | 115.16,51.79 C21.+ | C21.+ 117.46,51.8 116.84,51.8 116.84,58.15 112.39,62.6 112.39,69.58 111.39,70.58 106.31,70.58 | U$1.VBUS 120.56,48.7 C21.+ | IC5.4 110.7,46.51 109.85,47.36 109.85,48.63 109.22,49.26 104.14,49.26 | 106.31,70.58 101.87,70.58 100.96,69.68 DISCHRG.A 100.98,68.39 100.98,59.06 101.89,58.15 v102.87,58.15 | 106.31,70.58 107.58,69.31 107.58,68.77 CHRG.A
(copper drawn outside any net)
  shapes: Bottom area x4504

### Text on the board
tPlace: + | + | _
tNames: IC1 | W25QXX | IC5 | IC3 | TP4056 | IC6 | PAM8403 | MINI USB | BL8530 | PWR SRC / Li-Po / USB | IC7 | POT1 | LM1117